# EAGLE schematic Ready-UNO (EAGLE 7.5.0)
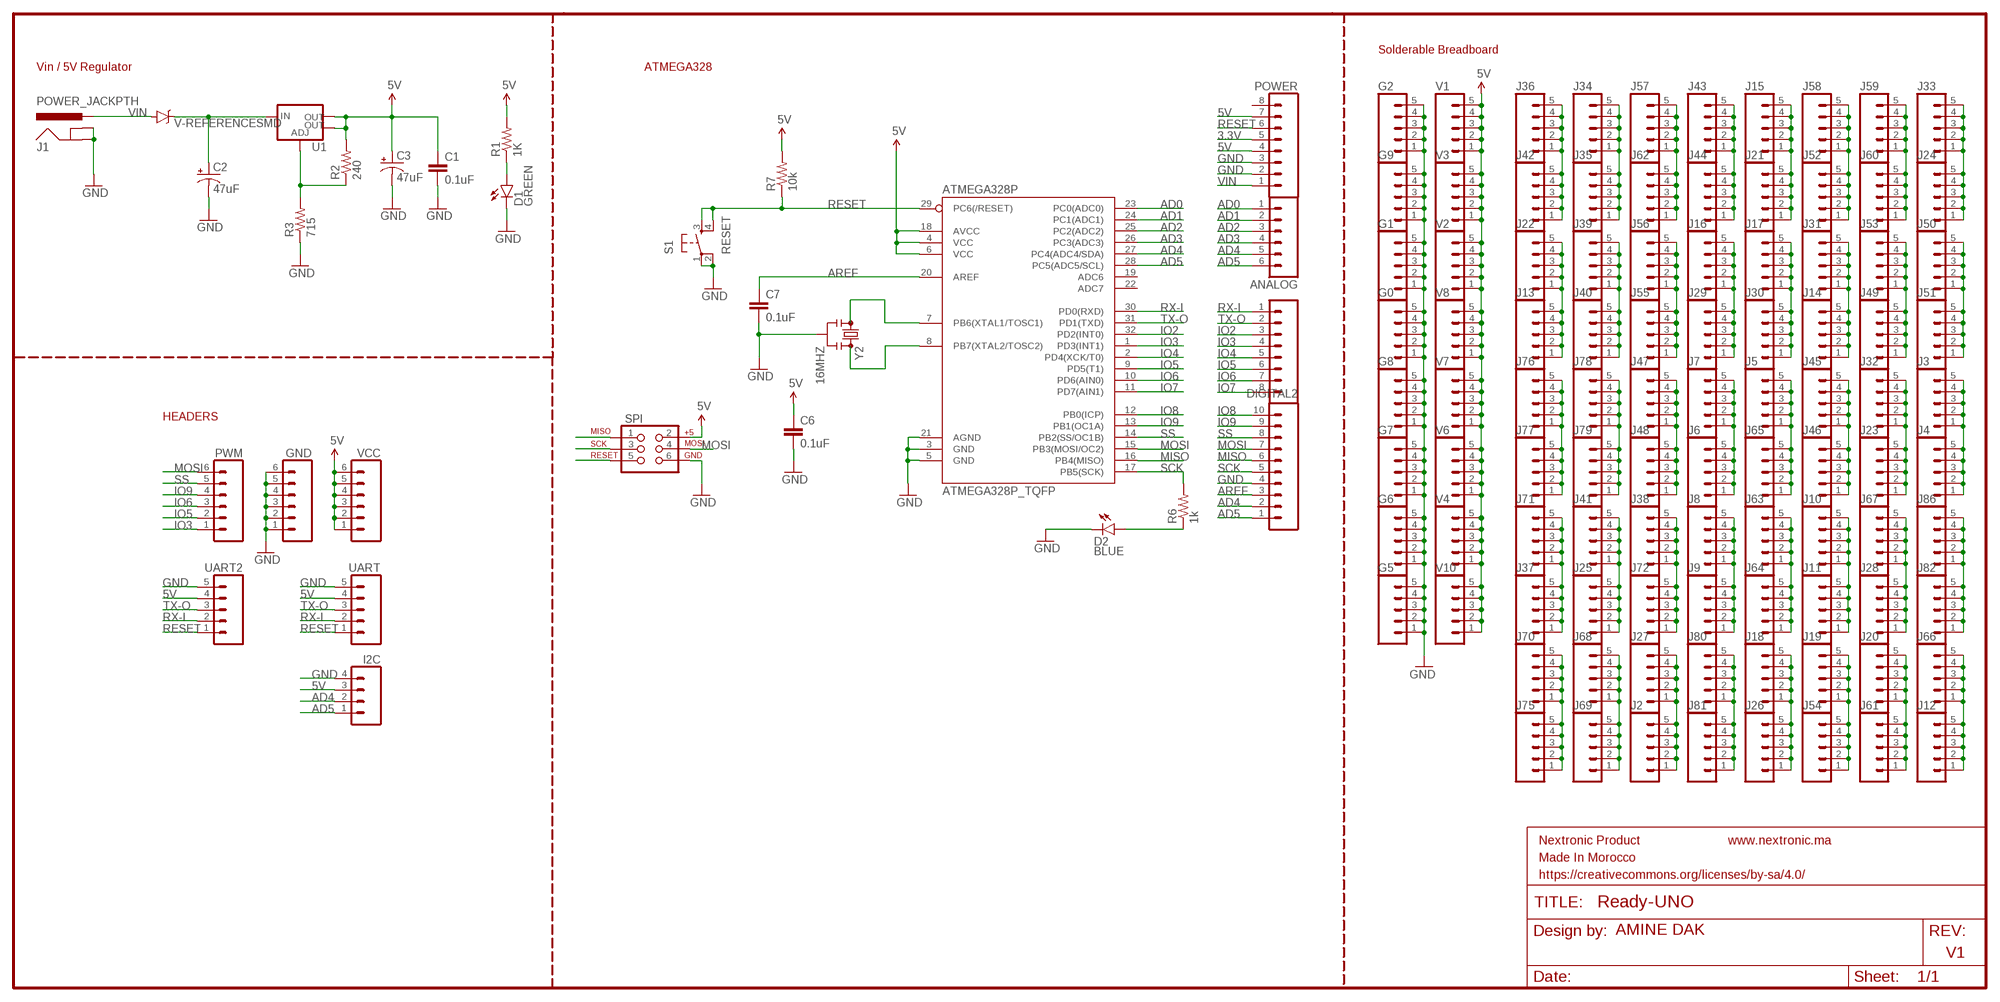
[diagram p0: schematic, sheet 1]

## Parts
ANALOG  M06SILK_FEMALE_PTH  [1X06]
ATMEGA328P  ATMEGA328P_TQFP  [TQFP32-08]
C1  0.1uF  CAP0603-CAP  [0603-CAP]
C2  47uF  CAP_POLC  [PANASONIC_C]
C3  47uF  CAP_POLC  [PANASONIC_C]
C6  0.1uF  CAP0603-CAP  [0603-CAP]
C7  0.1uF  CAP0603-CAP  [0603-CAP]
D1  GREEN  LED-GREEN1206  [LED-1206]
D2  BLUE  LED-BLUE1206  [LED-1206]
DIGITAL  M08SILK_FEMALE_PTH  [1X08]
DIGITAL2  M10SILK_FEMALE_PTH  [1X10]
G0  M05PTH  [1X05]
G1  M05PTH  [1X05]
G2  M05PTH  [1X05]
G5  M05PTH  [1X05]
G6  M05PTH  [1X05]
G7  M05PTH  [1X05]
G8  M05PTH  [1X05]
G9  M05PTH  [1X05]
GND  M06SILK_FEMALE_PTH  [1X06]
I2C  M04PTH  [1X04]
J1  POWER_JACKPTH  [POWER_JACK_PTH]
J2  M05PTH  [1X05]
J3  M05PTH  [1X05]
J4  M05PTH  [1X05]
J5  M05PTH  [1X05]
J6  M05PTH  [1X05]
J7  M05PTH  [1X05]
J8  M05PTH  [1X05]
J9  M05PTH  [1X05]
J10  M05PTH  [1X05]
J11  M05PTH  [1X05]
J12  M05PTH  [1X05]
J13  M05PTH  [1X05]
J14  M05PTH  [1X05]
J15  M05PTH  [1X05]
J16  M05PTH  [1X05]
J17  M05PTH  [1X05]
J18  M05PTH  [1X05]
J19  M05PTH  [1X05]
J20  M05PTH  [1X05]
J21  M05PTH  [1X05]
J22  M05PTH  [1X05]
J23  M05PTH  [1X05]
J24  M05PTH  [1X05]
J25  M05PTH  [1X05]
J26  M05PTH  [1X05]
J27  M05PTH  [1X05]
J28  M05PTH  [1X05]
J29  M05PTH  [1X05]
J30  M05PTH  [1X05]
J31  M05PTH  [1X05]
J32  M05PTH  [1X05]
J33  M05PTH  [1X05]
J34  M05PTH  [1X05]
J35  M05PTH  [1X05]
J36  M05PTH  [1X05]
J37  M05PTH  [1X05]
J38  M05PTH  [1X05]
J39  M05PTH  [1X05]
J40  M05PTH  [1X05]
J41  M05PTH  [1X05]
J42  M05PTH  [1X05]
J43  M05PTH  [1X05]
J44  M05PTH  [1X05]
J45  M05PTH  [1X05]
J46  M05PTH  [1X05]
J47  M05PTH  [1X05]
J48  M05PTH  [1X05]
J49  M05PTH  [1X05]
J50  M05PTH  [1X05]
J51  M05PTH  [1X05]
J52  M05PTH  [1X05]
J53  M05PTH  [1X05]
J54  M05PTH  [1X05]
J55  M05PTH  [1X05]
J56  M05PTH  [1X05]
J57  M05PTH  [1X05]
J58  M05PTH  [1X05]
J59  M05PTH  [1X05]
J60  M05PTH  [1X05]
J61  M05PTH  [1X05]
J62  M05PTH  [1X05]
J63  M05PTH  [1X05]
J64  M05PTH  [1X05]
J65  M05PTH  [1X05]
J66  M05PTH  [1X05]
J67  M05PTH  [1X05]
J68  M05PTH  [1X05]
J69  M05PTH  [1X05]
J70  M05PTH  [1X05]
J71  M05PTH  [1X05]
J72  M05PTH  [1X05]
J75  M05PTH  [1X05]
J76  M05PTH  [1X05]
J77  M05PTH  [1X05]
J78  M05PTH  [1X05]
J79  M05PTH  [1X05]
J80  M05PTH  [1X05]
J81  M05PTH  [1X05]
J82  M05PTH  [1X05]
J86  M05PTH  [1X05]
POWER  M08SILK_FEMALE_PTH  [1X08]
PWM  M06SILK_FEMALE_PTH  [1X06]
R1  1K  RESISTOR0603-RES  [0603-RES]
R2  240  RESISTOR0603-RES  [0603-RES]
R3  715  RESISTOR0603-RES  [0603-RES]
R6  1k  RESISTOR0603-RES  [0603-RES]
R7  10k  RESISTOR0603-RES  [0603-RES]
S1  RESET  TAC_SWITCHSMD  [TACTILE-SWITCH-SMD]
SPI  AVR_SPI_PRG_6NS  [2X3-NS]
U1  V_REG_LM1117SOT223  [SOT223]
U$1  V-REFERENCESMD  [SOT23-3]
UART  M05PTH  [1X05]
UART2  M05PTH  [1X05]
V1  M05PTH  [1X05]
V2  M05PTH  [1X05]
V3  M05PTH  [1X05]
V4  M05PTH  [1X05]
V6  M05PTH  [1X05]
V7  M05PTH  [1X05]
V8  M05PTH  [1X05]
V10  M05PTH  [1X05]
VCC  M06SILK_FEMALE_PTH  [1X06]
Y2  16MHZ  RESONATOR16MHZ  [RESONATOR-SMD]

## Nets
3.3V: POWER.5
5V: ATMEGA328P.4(VCC) ATMEGA328P.6(VCC) ATMEGA328P.18(AVCC) C1.1 C3.+ C6.1 I2C.3 POWER.4 POWER.7 R1.2 R2.2 R7.2 SPI.2 U1.2(OUT) U1.4(OUT) UART2.4 UART.4 V1.1 V1.2 V1.3 V1.4 V1.5 V2.1 V2.2 V2.3 V2.4 V2.5 V3.1 V3.2 V3.3 V3.4 V3.5 V4.1 V4.2 V4.3 V4.4 V4.5 V6.1 V6.2 V6.3 V6.4 V6.5 V7.1 V7.2 V7.3 V7.4 V7.5 V8.1 V8.2 V8.3 V8.4 V8.5 V10.1 V10.2 V10.3 V10.4 V10.5 VCC.1 VCC.2 VCC.3 VCC.4 VCC.5 VCC.6
AD0: ANALOG.1 ATMEGA328P.23(PC0(ADC0))
AD1: ANALOG.2 ATMEGA328P.24(PC1(ADC1))
AD2: ANALOG.3 ATMEGA328P.25(PC2(ADC2))
AD3: ANALOG.4 ATMEGA328P.26(PC3(ADC3))
AD4: ANALOG.5 ATMEGA328P.27(PC4(ADC4/SDA)) DIGITAL2.2 I2C.2
AD5: ANALOG.6 ATMEGA328P.28(PC5(ADC5/SCL)) DIGITAL2.1 I2C.1
AREF: ATMEGA328P.20(AREF) C7.1 DIGITAL2.3
GND: ATMEGA328P.3(GND) ATMEGA328P.5(GND) ATMEGA328P.21(AGND) C1.2 C2.- C3.- C6.2 C7.2 D1.C D2.C DIGITAL2.4 G0.1 G0.2 G0.3 G0.4 G0.5 G1.1 G1.2 G1.3 G1.4 G1.5 G2.1 G2.2 G2.3 G2.4 G2.5 G5.1 G5.2 G5.3 G5.4 G5.5 G6.1 G6.2 G6.3 G6.4 G6.5 G7.1 G7.2 G7.3 G7.4 G7.5 G8.1 G8.2 G8.3 G8.4 G8.5 G9.1 G9.2 G9.3 G9.4 G9.5 GND.1 GND.2 GND.3 GND.4 GND.5 GND.6 I2C.4 J1.GND J1.GNDBREAK POWER.2 POWER.3 R3.1 S1.1 S1.2 SPI.6 UART2.5 UART.5 Y2.2
IO2: ATMEGA328P.32(PD2(INT0)) DIGITAL.3
IO3: ATMEGA328P.1(PD3(INT1)) DIGITAL.4 PWM.1
IO4: ATMEGA328P.2(PD4(XCK/T0)) DIGITAL.5
IO5: ATMEGA328P.9(PD5(T1)) DIGITAL.6 PWM.2
IO6: ATMEGA328P.10(PD6(AIN0)) DIGITAL.7 PWM.3
IO7: ATMEGA328P.11(PD7(AIN1)) DIGITAL.8
IO8: ATMEGA328P.12(PB0(ICP)) DIGITAL2.10
IO9: ATMEGA328P.13(PB1(OC1A)) DIGITAL2.9 PWM.4
MISO: ATMEGA328P.16(PB4(MISO)) DIGITAL2.6 SPI.1
MOSI: ATMEGA328P.15(PB3(MOSI/OC2)) DIGITAL2.7 PWM.6 SPI.4
N$1: R2.1 R3.2 U1.1(ADJ)
N$2: D2.A R6.1
N$3: C2.+ U1.3(IN) U$1.1(C)
N$4: D1.A R1.1
N$6: J37.1 J37.2 J37.3 J37.4 J37.5 J71.1 J71.2 J71.3 J71.4 J71.5
N$7: ATMEGA328P.7(PB6(XTAL1/TOSC1)) Y2.1
N$8: ATMEGA328P.8(PB7(XTAL2/TOSC2)) Y2.3
N$9: J3.1 J3.2 J3.3 J3.4 J3.5 J4.1 J4.2 J4.3 J4.4 J4.5
N$11: J10.1 J10.2 J10.3 J10.4 J10.5 J11.1 J11.2 J11.3 J11.4 J11.5
N$12: J76.1 J76.2 J76.3 J76.4 J76.5 J77.1 J77.2 J77.3 J77.4 J77.5
N$13: J28.1 J28.2 J28.3 J28.4 J28.5 J67.1 J67.2 J67.3 J67.4 J67.5
N$14: J25.1 J25.2 J25.3 J25.4 J25.5 J41.1 J41.2 J41.3 J41.4 J41.5
N$15: J78.1 J78.2 J78.3 J78.4 J78.5 J79.1 J79.2 J79.3 J79.4 J79.5
N$16: J82.1 J82.2 J82.3 J82.4 J82.5 J86.1 J86.2 J86.3 J86.4 J86.5
N$17: J45.1 J45.2 J45.3 J45.4 J45.5 J46.1 J46.2 J46.3 J46.4 J46.5
N$19: J47.1 J47.2 J47.3 J47.4 J47.5 J48.1 J48.2 J48.3 J48.4 J48.5
N$20: J12.1 J12.2 J12.3 J12.4 J12.5 J66.1 J66.2 J66.3 J66.4 J66.5
N$21: J20.1 J20.2 J20.3 J20.4 J20.5 J61.1 J61.2 J61.3 J61.4 J61.5
N$23: J38.1 J38.2 J38.3 J38.4 J38.5 J72.1 J72.2 J72.3 J72.4 J72.5
N$24: J24.1 J24.2 J24.3 J24.4 J24.5 J33.1 J33.2 J33.3 J33.4 J33.5
N$25: J23.1 J23.2 J23.3 J23.4 J23.5 J32.1 J32.2 J32.3 J32.4 J32.5
N$27: J49.1 J49.2 J49.3 J49.4 J49.5 J53.1 J53.2 J53.3 J53.4 J53.5
N$28: J59.1 J59.2 J59.3 J59.4 J59.5 J60.1 J60.2 J60.3 J60.4 J60.5
N$29: J14.1 J14.2 J14.3 J14.4 J14.5 J31.1 J31.2 J31.3 J31.4 J31.5
N$30: J17.1 J17.2 J17.3 J17.4 J17.5 J30.1 J30.2 J30.3 J30.4 J30.5
N$31: J52.1 J52.2 J52.3 J52.4 J52.5 J58.1 J58.2 J58.3 J58.4 J58.5
N$32: J50.1 J50.2 J50.3 J50.4 J50.5 J51.1 J51.2 J51.3 J51.4 J51.5
N$33: J16.1 J16.2 J16.3 J16.4 J16.5 J29.1 J29.2 J29.3 J29.4 J29.5
N$34: J43.1 J43.2 J43.3 J43.4 J43.5 J44.1 J44.2 J44.3 J44.4 J44.5
N$35: J15.1 J15.2 J15.3 J15.4 J15.5 J21.1 J21.2 J21.3 J21.4 J21.5
N$36: J36.1 J36.2 J36.3 J36.4 J36.5 J42.1 J42.2 J42.3 J42.4 J42.5
N$37: J13.1 J13.2 J13.3 J13.4 J13.5 J22.1 J22.2 J22.3 J22.4 J22.5
N$38: J6.1 J6.2 J6.3 J6.4 J6.5 J7.1 J7.2 J7.3 J7.4 J7.5
N$39: J8.1 J8.2 J8.3 J8.4 J8.5 J9.1 J9.2 J9.3 J9.4 J9.5
N$40: J34.1 J34.2 J34.3 J34.4 J34.5 J35.1 J35.2 J35.3 J35.4 J35.5
N$41: J39.1 J39.2 J39.3 J39.4 J39.5 J40.1 J40.2 J40.3 J40.4 J40.5
N$42: J5.1 J5.2 J5.3 J5.4 J5.5 J65.1 J65.2 J65.3 J65.4 J65.5
N$43: J63.1 J63.2 J63.3 J63.4 J63.5 J64.1 J64.2 J64.3 J64.4 J64.5
N$44: J57.1 J57.2 J57.3 J57.4 J57.5 J62.1 J62.2 J62.3 J62.4 J62.5
N$45: J55.1 J55.2 J55.3 J55.4 J55.5 J56.1 J56.2 J56.3 J56.4 J56.5
N$46: J19.1 J19.2 J19.3 J19.4 J19.5 J54.1 J54.2 J54.3 J54.4 J54.5
N$47: J80.1 J80.2 J80.3 J80.4 J80.5 J81.1 J81.2 J81.3 J81.4 J81.5
N$48: J18.1 J18.2 J18.3 J18.4 J18.5 J26.1 J26.2 J26.3 J26.4 J26.5
N$49: J70.1 J70.2 J70.3 J70.4 J70.5 J75.1 J75.2 J75.3 J75.4 J75.5
N$50: J2.1 J2.2 J2.3 J2.4 J2.5 J27.1 J27.2 J27.3 J27.4 J27.5
N$51: J68.1 J68.2 J68.3 J68.4 J68.5 J69.1 J69.2 J69.3 J69.4 J69.5
RESET: ATMEGA328P.29(PC6(/RESET)) POWER.6 R7.1 S1.3 S1.4 SPI.5 UART2.1 UART.1
RX-I: ATMEGA328P.30(PD0(RXD)) DIGITAL.1 UART2.2 UART.2
SCK: ATMEGA328P.17(PB5(SCK)) DIGITAL2.5 R6.2 SPI.3
SS: ATMEGA328P.14(PB2(SS/OC1B)) DIGITAL2.8 PWM.5
TX-O: ATMEGA328P.31(PD1(TXD)) DIGITAL.2 UART2.3 UART.3
VIN: J1.PWR POWER.1 U$1.2(A)
Unconnected: ATMEGA328P.19(ADC6) ATMEGA328P.22(ADC7) POWER.8

## Notes on the sheet
- Solderable Breadboard
- Vin / 5V Regulator | ATMEGA328
- HEADERS
- Nextronic Product | www.nextronic.ma
- Made In Morocco
- https://creativecommons.org/licenses/by-sa/4.0/
- TITLE:
- Design by: | AMINE DAK | REV:
- V1
- Date: | Sheet:

## Library data of the parts
ANALOG GND PWM VCC = SparkFun-Connectors:M06: Header 6 Standard 6-pin 0.1" header. Use with straight break away headers (SKU : PRT-00116), right angle break away headers (PRT-00553), swiss pins (PRT-00743), machine pins (PRT-00117), and female headers (PRT-00115). Molex polarized connector foot print use with SKU : PRT-08094 with associated crimp pins and housings. NOTES ON THE VARIANTS LOCK and LOCK_LONGPADS... This footprint was designed to help hold the alignment of a through-hole component (i.e. 6-pin header) while soldering it into place. You may notice that each hole has been shifted either up or down by 0.005 of an inch from it's more standard position (which is a perfectly straight line). This slight alteration caused the pins (the squares in the middle) to touch the edges of the holes. Because they are alternating, it causes a "brace" to hold the component in place. 0.005 has proven to be the perfect amount of "off-center" position when using our standard breakaway headers. Although looks a little odd when you look at the bare footprint, once you have a header in there, the alteration is very hard to notice. Also,if you push a header all the way into place, it is covered up entirely on the bottom side. This idea of altering the position of holes to aid alignment will be further integrated into the Sparkfun Library for other footprints. It can help hold any component with 3 or more connection pins.; OC_FARNELL: unknown; PROD_ID: CONN-08437
ATMEGA328P = SparkFun-DigitalIC:ATMEGA328P_TQFP; OC_FARNELL: unknown; PROD_ID: IC-09069
C1 C6 C7 = SparkFun-Passives:CAP: Capacitor Standard 0603 ceramic capacitor, and 0.1" leaded capacitor.; OC_FARNELL: unknown
C2 C3 = SparkFun-Capacitors:CAP_POL: Capacitor Polarized These are standard SMD and PTH capacitors. Normally 10uF, 47uF, and 100uF in electrolytic and tantalum varieties. Always verify the external diameter of the through hole cap, it varies with capacity, voltage, and manufacturer. The EIA devices should be standard.; OC_FARNELL: unknown
D1 = SparkFun-LED:LED-GREEN: Various green LEDs Green LEDs used in SFE Production 0603- DIO-00821 LARGE- DIO-00862 LILYPAD- DIO-09910; OC_FARNELL: unknown; PROD_ID: DIO-00862
D2 = SparkFun-LED:LED-BLUE: Blue LEDs for production use Various blue LEDs stocked by SparkFun production 0603 - DIO-08575 Rebel - DIO-09553 1206 - DIO-09911; OC_FARNELL: unknown; PROD_ID: DIO-09911
DIGITAL POWER = SparkFun-Connectors:M08: Header 8 Standard 8-pin 0.1" header. Use with straight break away headers (SKU : PRT-00116), right angle break away headers (PRT-00553), swiss pins (PRT-00743), machine pins (PRT-00117), and female headers (PRT-00115).; OC_FARNELL: unknown; PROD_ID: CONN-08438
DIGITAL2 = SparkFun-Connectors:M10: Header 10 Standard 10-pin 0.1" header. Use with straight break away headers (SKU : PRT-00116), right angle break away headers (PRT-00553), swiss pins (PRT-00743), machine pins (PRT-00117), and female headers (PRT-00115).; OC_FARNELL: unknown; PROD_ID: CONN-11563
G0 G1 G2 G5-G9 J2-J72 J75-J82 J86 UART UART2 V1-V4 V6-V8 V10 = SparkFun-Connectors:M05: Header 5 Standard 5-pin 0.1" header. Use with straight break away headers (SKU : PRT-00116), right angle break away headers (PRT-00553), swiss pins (PRT-00743), machine pins (PRT-00117), and female headers (PRT-00115). Molex polarized connector foot print use with SKU : PRT-08230 with associated crimp pins and housings.; OC_FARNELL: unknown
I2C = SparkFun-Connectors:M04: Header 4 Standard 4-pin 0.1" header. Use with straight break away headers (SKU : PRT-00116), right angle break away headers (PRT-00553), swiss pins (PRT-00743), machine pins (PRT-00117), and female headers (PRT-00115). Molex polarized connector foot print use with SKU : PRT-08231 with associated crimp pins and housings. 1MM SMD Version SKU: PRT-10208; OC_FARNELL: unknown; PROD_ID: CONN-09696
J1 = SparkFun-Connectors:POWER_JACK: Power Jack This is the standard 5.5mm barrel jack for power. The PTH is the most common, proven, reliable, footprint. The Slot footprint only works if the mill layer is transmitted to the PCB fab house so be warned. Mating wall wart : TOL-00298 (and others); OC_FARNELL: unknown; PROD_ID: CONN-08197
R1-R3 R6 R7 = SparkFun-Passives:RESISTOR: Resistor Basic schematic elements and footprints for 0603, 1206, and PTH resistors.; OC_FARNELL: unknown
S1 = SparkFun-Retired:TAC_SWITCH: Momentary Switch Button commonly used for reset or general input. Spark Fun Electronics SKU : COM-00097 SMT- SWCH-08247; OC_FARNELL: unknown; PROD_ID: SWCH-08247; VALUE: TAC_SWITCHSMD
SPI = SparkFun-Connectors:AVR_SPI_PRG_6: AVR ISP 6 Pin This is the reduced ISP connector for AVR programming. Common on Arduino. This footprint will take up less PCB space and can be used with a 10-pin to 6-pin adapter such as SKU: BOB-08508 **Special note about "TEST_POINT" package. The stop mask is on the top side, so if you want your programming test points to be on the bottom of your board, make sure to place this package on the bottom side of the board. This also ensure that the orientation to program from the bottom side will be correct.; OC_FARNELL: unknown
U1 = SparkFun-PowerIC:V_REG_LM1117: Voltage Regulator LM1117 Standard adjustable voltage regulator but in SMD form. Spark Fun Electronics SKU : COM-00595; OC_FARNELL: unknown; PROD_ID: VREG-08170
U$1 = SparkFun-DiscreteSemi:V-REFERENCE: Zener diode; OC_FARNELL: unknown
Y2 = SparkFun-FreqCtrl:RESONATOR: Resonator Small SMD resonator. Used, eg, on the Arduino Pro/ Pro Mini boards. 8MHz- XTAL-08895 16MHz- XTAL-08900; OC_FARNELL: unknown; PROD_ID: XTAL-08900